# Altium project RainbowClock.PrjPcb
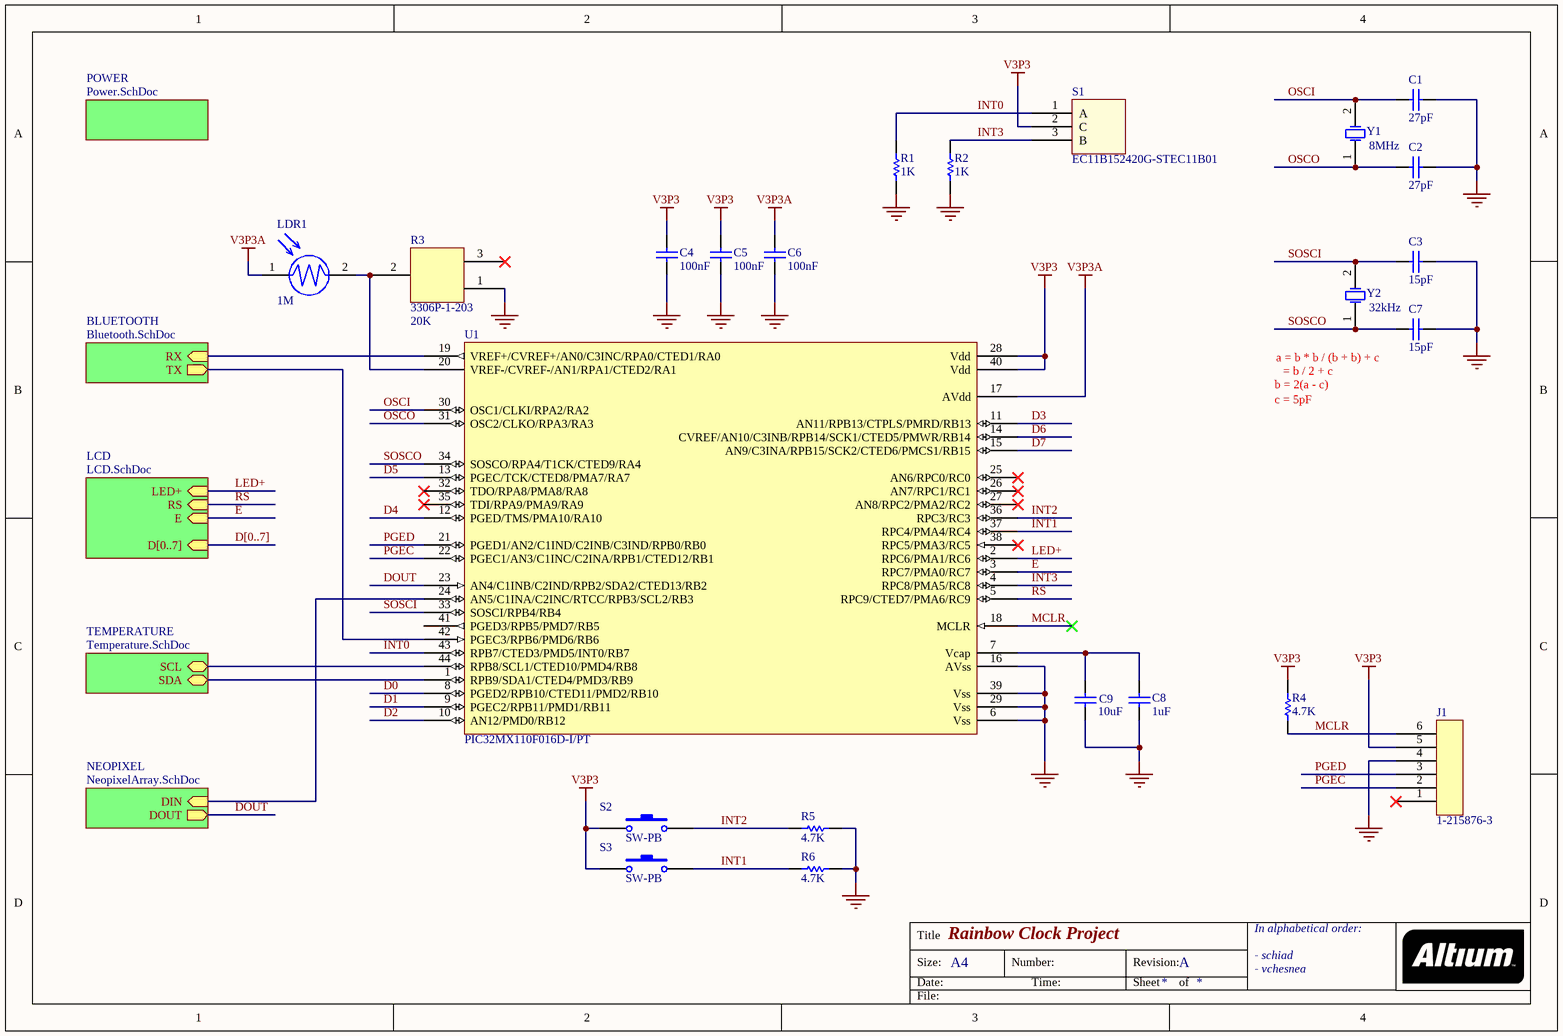
[diagram p0: RainbowClock.SchDoc]
7 sheets, 158 parts. Net scope: hierarchical (ports join the sheet entries above them; power ports are global).
Board file: BoardV2.PcbDoc
Sheets:
  RainbowClock.SchDoc
    BLUETOOTH = Bluetooth.SchDoc
    LCD = LCD.SchDoc
    TEMPERATURE = Temperature.SchDoc
    NEOPIXEL = NeopixelArray.SchDoc
      NeoPixel1 = Neopixel.SchDoc
      NeoPixel2 = Neopixel.SchDoc
      NeoPixel3 = Neopixel.SchDoc
      NeoPixel4 = Neopixel.SchDoc
      NeoPixel5 = Neopixel.SchDoc
      NeoPixel6 = Neopixel.SchDoc
      NeoPixel7 = Neopixel.SchDoc
      NeoPixel8 = Neopixel.SchDoc
      NeoPixel9 = Neopixel.SchDoc
      NeoPixel10 = Neopixel.SchDoc
      NeoPixel11 = Neopixel.SchDoc
      NeoPixel12 = Neopixel.SchDoc
      NeoPixel13 = Neopixel.SchDoc
      NeoPixel14 = Neopixel.SchDoc
      NeoPixel15 = Neopixel.SchDoc
      NeoPixel16 = Neopixel.SchDoc
      NeoPixel17 = Neopixel.SchDoc
      NeoPixel18 = Neopixel.SchDoc
      NeoPixel19 = Neopixel.SchDoc
      NeoPixel20 = Neopixel.SchDoc
      NeoPixel21 = Neopixel.SchDoc
      NeoPixel22 = Neopixel.SchDoc
      NeoPixel23 = Neopixel.SchDoc
      NeoPixel24 = Neopixel.SchDoc
      NeoPixel25 = Neopixel.SchDoc
      NeoPixel26 = Neopixel.SchDoc
      NeoPixel27 = Neopixel.SchDoc
      NeoPixel28 = Neopixel.SchDoc
      NeoPixel29 = Neopixel.SchDoc
      NeoPixel30 = Neopixel.SchDoc
      NeoPixel31 = Neopixel.SchDoc
      NeoPixel32 = Neopixel.SchDoc
      NeoPixel33 = Neopixel.SchDoc
      NeoPixel34 = Neopixel.SchDoc
      NeoPixel35 = Neopixel.SchDoc
      NeoPixel36 = Neopixel.SchDoc
      NeoPixel37 = Neopixel.SchDoc
      NeoPixel38 = Neopixel.SchDoc
      NeoPixel39 = Neopixel.SchDoc
      NeoPixel40 = Neopixel.SchDoc
      NeoPixel41 = Neopixel.SchDoc
      NeoPixel42 = Neopixel.SchDoc
      NeoPixel43 = Neopixel.SchDoc
      NeoPixel44 = Neopixel.SchDoc
      NeoPixel45 = Neopixel.SchDoc
      NeoPixel46 = Neopixel.SchDoc
      NeoPixel47 = Neopixel.SchDoc
      NeoPixel48 = Neopixel.SchDoc
      NeoPixel49 = Neopixel.SchDoc
      NeoPixel50 = Neopixel.SchDoc
      NeoPixel51 = Neopixel.SchDoc
      NeoPixel52 = Neopixel.SchDoc
      NeoPixel53 = Neopixel.SchDoc
      NeoPixel54 = Neopixel.SchDoc
      NeoPixel55 = Neopixel.SchDoc
      NeoPixel56 = Neopixel.SchDoc
      NeoPixel57 = Neopixel.SchDoc
      NeoPixel58 = Neopixel.SchDoc
      NeoPixel59 = Neopixel.SchDoc
      NeoPixel60 = Neopixel.SchDoc
    POWER = Power.SchDoc

## Sheet RainbowClock.SchDoc: Rainbow Clock Project
size A4; DrawnBy: vchesnea; Organization: In alphabetical order:; Address2: - schiad; Address3: - vchesnea; Revision: A

### Parts
C1  27pF  [CAP0603]
C2  27pF  [CAP0603]
C3  15pF  [CAP0603]
C4  100nF  [CAP0603]
C5  100nF  [CAP0603]
C6  100nF  [CAP0603]
C7  15pF  [CAP0603]
C8  1uF  [CAP0603]
C9  10uF  [CAP0603]
J1  1-215876-3  [1-215876-3]
LDR1  value 1M  [VT935G]  (hidden comment: LDR)
R1  1K  [RES0603]
R2  1K  [RES0603]
R3  3306P-1-203  value 20K  [3306P-1-202]
R4  4.7K  [RES0603]
R5  4.7K  [RES0603]
R6  4.7K  [RES0603]
S1  EC11B152420G-STEC11B01  [EC11B152420G-STEC11B01]
S2  SW-PB  [1-1825027-4]
S3  SW-PB  [1-1825027-4]
U1  PIC32MX110F016D-I/PT  [PIC32MX110F016H-I/PT]
Y1  value 8MHz  [FOXSLF/080-20]  (hidden comment: 8MHz XTAL)
Y2  value 32kHz  [NCL38LF]  (hidden comment: 32kHz XTAL)

### Sub-sheets
BLUETOOTH = Bluetooth.SchDoc: RX (in), TX (out)
LCD = LCD.SchDoc: RS (in), E (in), LED+ (in), D[0..7] (in)
NEOPIXEL = NeopixelArray.SchDoc: DIN (in), DOUT (out)
POWER = Power.SchDoc: no entries
TEMPERATURE = Temperature.SchDoc: SDA (bidir), SCL (bidir)

### Nets
GND: C1.2 C2.2 C3.2 C4.1 C5.1 C6.1 C7.2 C8.1 C9.1 J1.4 R1.2 R2.1 R3.1 R5.1 R6.1 U1.6(Vss) U1.16(AVss) U1.29(Vss) U1.39(Vss)
V3P3: C4.2 C5.2 J1.5 R4.2 S1.2(C) S2.1 S3.2 U1.28(Vdd) U1.40(Vdd)
V3P3A: C6.2 LDR1.1 U1.17(AVdd)
D0: U1.8(PGED2/RPB10/CTED11/PMD2/RB10)
D1: U1.9(PGEC2/RPB11/PMD1/RB11)
D2: U1.10(AN12/PMD0/RB12)
D3: U1.11(AN11/RPB13/CTPLS/PMRD/RB13)
D4: U1.12(PGED/TMS/PMA10/RA10)
D5: U1.13(PGEC/TCK/CTED8/PMA7/RA7)
D6: U1.14(CVREF/AN10/C3INB/RPB14/SCK1/CTED5/PMWR/RB14)
D7: U1.15(AN9/C3INA/RPB15/SCK2/CTED6/PMCS1/RB15)
DOUT: U1.23(AN4/C1INB/C2IND/RPB2/SDA2/CTED13/RB2) ; sheet NEOPIXEL/DOUT
E: U1.3(RPC7/PMA0/RC7) ; sheet LCD/E
INT0: R1.1 S1.1(A) U1.43(RPB7/CTED3/PMD5/INT0/RB7)
INT1: R6.2 S3.1 U1.37(RPC4/PMA4/RC4)
INT2: R5.2 S2.2 U1.36(RPC3/RC3)
INT3: R2.2 S1.3(B) U1.4(RPC8/PMA5/RC8)
LED+: U1.2(RPC6/PMA1/RC6) ; sheet LCD/LED+
MCLR: J1.6 R4.1 U1.18(MCLR)
OSCI: C1.1 U1.30(OSC1/CLKI/RPA2/RA2) Y1.2(OSC2)
OSCO: C2.1 U1.31(OSC2/CLKO/RPA3/RA3) Y1.1(OSC1)
PGEC: J1.2 U1.22(PGEC1/AN3/C1INC/C2INA/RPB1/CTED12/RB1)
PGED: J1.3 U1.21(PGED1/AN2/C1IND/C2INB/C3IND/RPB0/RB0)
PX1: U1.24(AN5/C1INA/C2INC/RTCC/RPB3/SCL2/RB3) ; sheet NEOPIXEL/DIN
RS: U1.5(RPC9/CTED7/PMA6/RC9) ; sheet LCD/RS
RX: U1.19(VREF+/CVREF+/AN0/C3INC/RPA0/CTED1/RA0) ; sheet BLUETOOTH/RX
SCL: U1.44(RPB8/SCL1/CTED10/PMD4/RB8) ; sheet TEMPERATURE/SCL
SDA: U1.1(RPB9/SDA1/CTED4/PMD3/RB9) ; sheet TEMPERATURE/SDA
SOSCI: C3.1 U1.33(SOSCI/RPB4/RB4) Y2.2(OSC2)
SOSCO: C7.1 U1.34(SOSCO/RPA4/T1CK/CTED9/RA4) Y2.1(OSC1)
TX: U1.42(PGEC3/RPB6/PMD6/RB6) ; sheet BLUETOOTH/TX
NetC8_2: C8.2 C9.2 U1.7(Vcap)
NetLDR1_2: LDR1.2 R3.2 U1.20(VREF-/CVREF-/AN1/RPA1/CTED2/RA1)

Not connected (* = marked no-connect by the designer): J1 1*; R3 3*; U1 25(AN6/RPC0/RC0)* 26(AN7/RPC1/RC1)* 27(AN8/RPC2/PMA2/RC2)* 32(TDO/RPA8/PMA8/RA8)* 35(TDI/RPA9/PMA9/RA9)* 38(RPC5/PMA3/RC5)* 41(PGED3/RPB5/PMD7/RB5)

### Buses and harness runs
bus D[0..7] = sheet LCD/D[0..7]

### Notes on the sheet
- (near C7) a = b * b / (b + b) + c
- = b / 2 + c
- b = 2(a - c)
- c = 5pF
- Title
- Size:
- Date:
- A4
- Number:
- Time:
- Revision:
- Sheet
- of
- File:

### Library data of the parts
C1-C9 = Cap: Capacitor
  C1 C2: Value: 27pF
  C3 C7: Value: 15pF
  C4-C6: Value: 100nF
  C8: Value: 1uF
  C9: Value: 10uF
J1 = 1-215876-3: Tyco 1-215876-3; RefFournisseur: 1773039; Fabricant: TE Connectivity; Fournisseur: Farnell; RefFabricant: 1-215876-3
LDR1 = LDR: Photoresistor; RefFournisseur: 1652638; Fabricant: Excelitas Tech; Fournisseur: Farnell; RefFabricant: VT935G
R1 R2 R4-R6 = Res1: Resistor
  R1 R2: Value: 1K
  R4-R6: Value: 4.7K
R3 = 3306P-1-202: Trimpot; RefFournisseur: 108240; Fabricant: Bourns; Fournisseur: Farnell; RefFabricant: 3306P-1-203
S1 = EC11B152420G-STEC11B01: Rotary encoder; RefFournisseur: 1191733; Fournisseur: Farnell; Fabricant: ALPS; RefFabricant: EC11B152420G-STEC11B01
S2 S3 = SW-PB: Switch; RefFournisseur: 2468742; Fournisseur: Farnell; Fabricant: TE Connectivity; RefFabricant: 1-1825027-4
U1 = PIC32MX110F016D-I/PT: Microcontroller; RefFournisseur: 2057068; Fabricant: Microchip; Fournisseur: Farnell; RefFabricant: PIC32MX110F016D-I/PT
Y1 = XTAL: Crystal Oscillator; Fournisseur: Farnell; Fabricant: Fox Electronics; RefFournisseur: 2057960; RefFabricant: FOXSLF/080-20
Y2 = XTAL: Crystal Oscillator; Fabricant: Fox Electronics; Fournisseur: Farnell; RefFabricant: NC38LF-327; RefFournisseur: 2064058

## Sheet Bluetooth.SchDoc: Serial to Bluetooth module
size A4
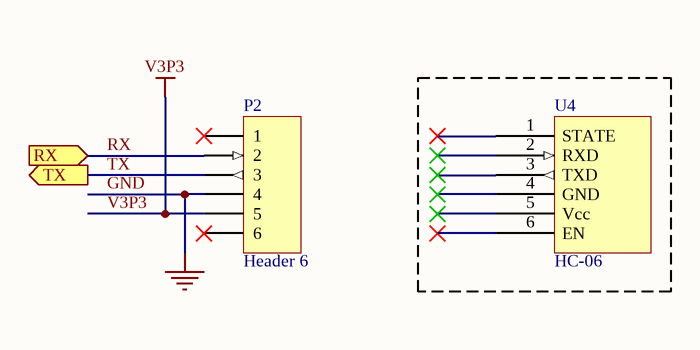
[diagram p1: Bluetooth.SchDoc]

### Parts
P2  Header 6  [Header 6]
U4  HC-06  (mechanical)

### Ports
RX (in), TX (out)

### Nets
GND: P2.4
V3P3: P2.5
RX: P2.2 ; port RX
TX: P2.3 ; port TX

Not connected (* = marked no-connect by the designer): P2 1* 6*; U4 1(STATE)* 2(RXD)* 3(TXD)* 4(GND)* 5(Vcc)* 6(EN)*

### Notes on the sheet
- Title
- Size:
- Date:
- A4
- Number:
- Time:
- Revision:
- Sheet
- of
- File:

### Library data of the parts
P2 = Header 6: Header, 6-Pin; Fabricant: MULTICOMP; Fournisseur: Farnell; RefFournisseur: 1593462; RefFabricant: 2212S-06SG-85
U4 = HC-06: Bluetooth; Fabricant: Wavesen; RefFabricant: HC-06

## Sheet LCD.SchDoc: 20x4 Characters LCD
size A4
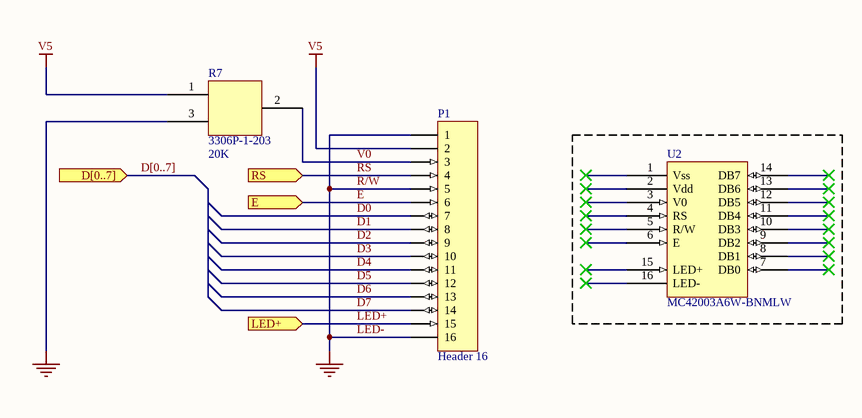
[diagram p2: LCD.SchDoc]

### Parts
P1  Header 16  [Header 16]
R7  3306P-1-203  value 20K  [3306P-1-202]
U2  MC42003A6W-BNMLW  [MC42004A6W-BNMLW]  (mechanical)

### Ports
D[0..7] (in), E (in), LED+ (in), RS (in)

### Nets
GND: P1.1 P1.5 P1.16 R7.3  [also labelled LED-, R/W]
V5: P1.2 R7.1
D0: P1.7
D1: P1.8
D2: P1.9
D3: P1.10
D4: P1.11
D5: P1.12
D6: P1.13
D7: P1.14
E: P1.6 ; port E
LED+: P1.15 ; port LED+
RS: P1.4 ; port RS
V0: P1.3 R7.2

Not connected (* = marked no-connect by the designer): U2 1(Vss)* 2(Vdd)* 3(V0)* 4(RS)* 5(R/W)* 6(E)* 7(DB0)* 8(DB1)* 9(DB2)* 10(DB3)* 11(DB4)* 12(DB5)* 13(DB6)* 14(DB7)* 15(LED+)* 16(LED-)*

### Buses and harness runs
bus D[0..7] = port D[0..7]

### Notes on the sheet
- Title
- Size:
- Date:
- A4
- Number:
- Time:
- Revision:
- Sheet
- of
- File:

### Library data of the parts
P1 = Header 16: Header, 16-Pin; Fabricant: SAMTEC; Fournisseur: Farnell; RefFabricant: CES-116-01-T-S; RefFournisseur: 1667522
R7 = 3306P-1-202: as R3 on sheet RainbowClock; RefFabricant: 3306P-1-203
U2 = MC42003A6W-BNMLW: LCD; Fabricant: MIDAS; Fournisseur: Farnell; RefFournisseur: 2063162; RefFabricant: MC42004A6W-BNMLW

## Sheet Temperature.SchDoc: BMP280 Sensor
size A4
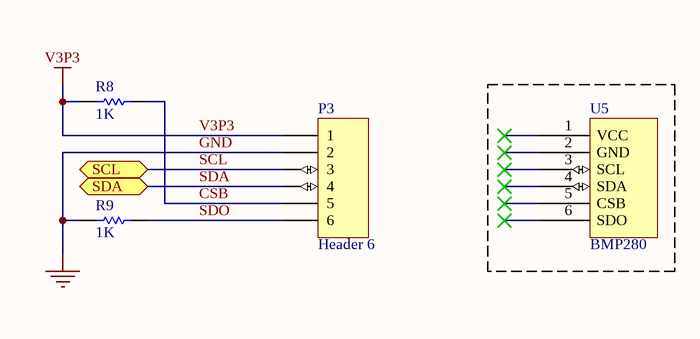
[diagram p3: Temperature.SchDoc]

### Parts
P3  Header 6  [Header 6]
R8  1K  [RES0603]
R9  1K  [RES0603]
U5  BMP280  (mechanical)

### Ports
SCL (bidir), SDA (bidir)

### Nets
GND: P3.2 R9.1
V3P3: P3.1 R8.1
CSB: P3.5 R8.2
SCL: P3.3 ; port SCL
SDA: P3.4 ; port SDA
SDO: P3.6 R9.2

Not connected (* = marked no-connect by the designer): U5 1(VCC)* 2(GND)* 3(SCL)* 4(SDA)* 5(CSB)* 6(SDO)*

### Notes on the sheet
- Title
- Size:
- Date:
- A4
- Number:
- Time:
- Revision:
- Sheet
- of
- File:

### Library data of the parts
P3 = Header 6: Header, 6-Pin; Fournisseur: Farnell; Fabricant: MULTICOMP; RefFournisseur: 1593462; RefFabricant: 2212S-06SG-85
R8 R9 = Res1: Resistor; Published: 8-Jun-2000; LatestRevisionDate: 17-Jul-2002; LatestRevisionNote: Re-released for DXP Platform.; PackageReference: AXIAL-0.3; Publisher: Altium Limited; PackageDescription: Axial Device, Thru-Hole; 2 Leads; 0.3 in Pin Spacing; Value: 1K
U5 = BMP280: Temp. sensor; Fabricant: BOSCH; RefFabricant: BMP280

## Sheet NeopixelArray.SchDoc: Neopixel array
size A4
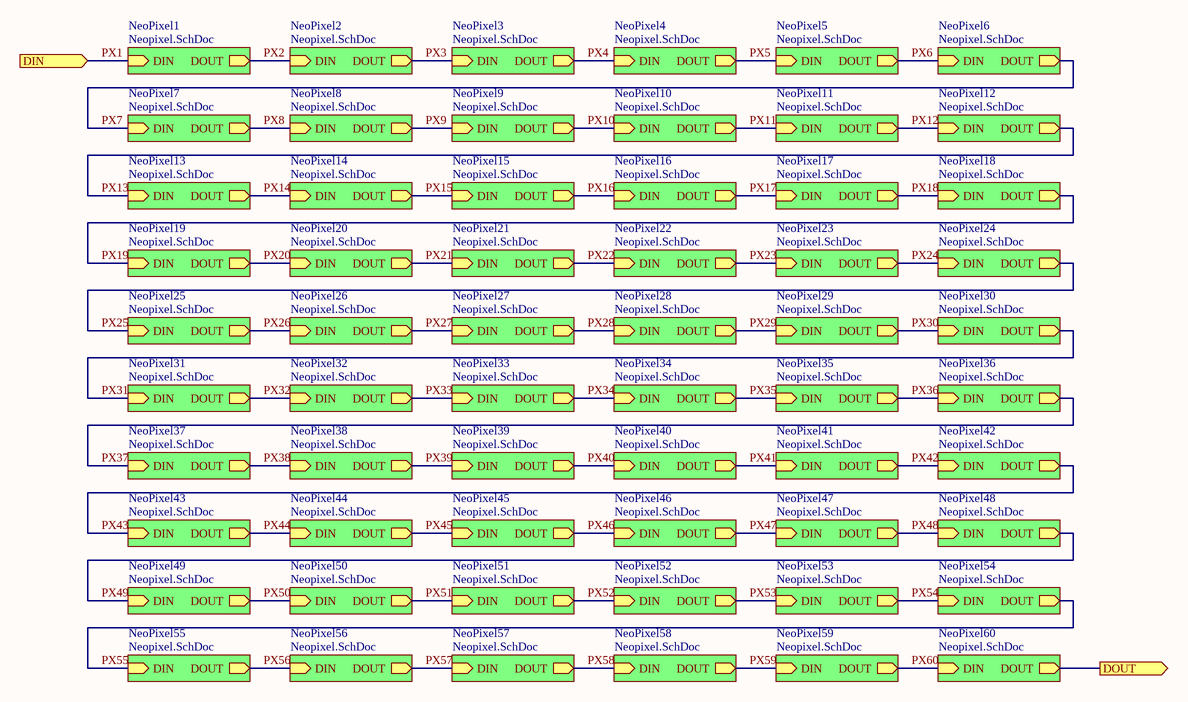
[diagram p4: NeopixelArray.SchDoc]

### Sub-sheets
NeoPixel1 = Neopixel.SchDoc: DIN (in), DOUT (out)
NeoPixel2 = Neopixel.SchDoc: DIN (in), DOUT (out)
NeoPixel3 = Neopixel.SchDoc: DIN (in), DOUT (out)
NeoPixel4 = Neopixel.SchDoc: DIN (in), DOUT (out)
NeoPixel5 = Neopixel.SchDoc: DIN (in), DOUT (out)
NeoPixel6 = Neopixel.SchDoc: DIN (in), DOUT (out)
NeoPixel7 = Neopixel.SchDoc: DIN (in), DOUT (out)
NeoPixel8 = Neopixel.SchDoc: DIN (in), DOUT (out)
NeoPixel9 = Neopixel.SchDoc: DIN (in), DOUT (out)
NeoPixel10 = Neopixel.SchDoc: DIN (in), DOUT (out)
NeoPixel11 = Neopixel.SchDoc: DIN (in), DOUT (out)
NeoPixel12 = Neopixel.SchDoc: DIN (in), DOUT (out)
NeoPixel13 = Neopixel.SchDoc: DIN (in), DOUT (out)
NeoPixel14 = Neopixel.SchDoc: DIN (in), DOUT (out)
NeoPixel15 = Neopixel.SchDoc: DIN (in), DOUT (out)
NeoPixel16 = Neopixel.SchDoc: DIN (in), DOUT (out)
NeoPixel17 = Neopixel.SchDoc: DIN (in), DOUT (out)
NeoPixel18 = Neopixel.SchDoc: DIN (in), DOUT (out)
NeoPixel19 = Neopixel.SchDoc: DIN (in), DOUT (out)
NeoPixel20 = Neopixel.SchDoc: DIN (in), DOUT (out)
NeoPixel21 = Neopixel.SchDoc: DIN (in), DOUT (out)
NeoPixel22 = Neopixel.SchDoc: DIN (in), DOUT (out)
NeoPixel23 = Neopixel.SchDoc: DIN (in), DOUT (out)
NeoPixel24 = Neopixel.SchDoc: DIN (in), DOUT (out)
NeoPixel25 = Neopixel.SchDoc: DIN (in), DOUT (out)
NeoPixel26 = Neopixel.SchDoc: DIN (in), DOUT (out)
NeoPixel27 = Neopixel.SchDoc: DIN (in), DOUT (out)
NeoPixel28 = Neopixel.SchDoc: DIN (in), DOUT (out)
NeoPixel29 = Neopixel.SchDoc: DIN (in), DOUT (out)
NeoPixel30 = Neopixel.SchDoc: DIN (in), DOUT (out)
NeoPixel31 = Neopixel.SchDoc: DIN (in), DOUT (out)
NeoPixel32 = Neopixel.SchDoc: DIN (in), DOUT (out)
NeoPixel33 = Neopixel.SchDoc: DIN (in), DOUT (out)
NeoPixel34 = Neopixel.SchDoc: DIN (in), DOUT (out)
NeoPixel35 = Neopixel.SchDoc: DIN (in), DOUT (out)
NeoPixel36 = Neopixel.SchDoc: DIN (in), DOUT (out)
NeoPixel37 = Neopixel.SchDoc: DIN (in), DOUT (out)
NeoPixel38 = Neopixel.SchDoc: DIN (in), DOUT (out)
NeoPixel39 = Neopixel.SchDoc: DIN (in), DOUT (out)
NeoPixel40 = Neopixel.SchDoc: DIN (in), DOUT (out)
NeoPixel41 = Neopixel.SchDoc: DIN (in), DOUT (out)
NeoPixel42 = Neopixel.SchDoc: DIN (in), DOUT (out)
NeoPixel43 = Neopixel.SchDoc: DIN (in), DOUT (out)
NeoPixel44 = Neopixel.SchDoc: DIN (in), DOUT (out)
NeoPixel45 = Neopixel.SchDoc: DIN (in), DOUT (out)
NeoPixel46 = Neopixel.SchDoc: DIN (in), DOUT (out)
NeoPixel47 = Neopixel.SchDoc: DIN (in), DOUT (out)
NeoPixel48 = Neopixel.SchDoc: DIN (in), DOUT (out)
NeoPixel49 = Neopixel.SchDoc: DIN (in), DOUT (out)
NeoPixel50 = Neopixel.SchDoc: DIN (in), DOUT (out)
NeoPixel51 = Neopixel.SchDoc: DIN (in), DOUT (out)
NeoPixel52 = Neopixel.SchDoc: DIN (in), DOUT (out)
NeoPixel53 = Neopixel.SchDoc: DIN (in), DOUT (out)
NeoPixel54 = Neopixel.SchDoc: DIN (in), DOUT (out)
NeoPixel55 = Neopixel.SchDoc: DIN (in), DOUT (out)
NeoPixel56 = Neopixel.SchDoc: DIN (in), DOUT (out)
NeoPixel57 = Neopixel.SchDoc: DIN (in), DOUT (out)
NeoPixel58 = Neopixel.SchDoc: DIN (in), DOUT (out)
NeoPixel59 = Neopixel.SchDoc: DIN (in), DOUT (out)
NeoPixel60 = Neopixel.SchDoc: DIN (in), DOUT (out)

### Ports
DIN (in), DOUT (out)

### Nets
DOUT: port DOUT, sheet NeoPixel60/DOUT
PX1: port DIN, sheet NeoPixel1/DIN
PX2: sheet NeoPixel1/DOUT, sheet NeoPixel2/DIN
PX3: sheet NeoPixel2/DOUT, sheet NeoPixel3/DIN
PX4: sheet NeoPixel3/DOUT, sheet NeoPixel4/DIN
PX5: sheet NeoPixel4/DOUT, sheet NeoPixel5/DIN
PX6: sheet NeoPixel5/DOUT, sheet NeoPixel6/DIN
PX7: sheet NeoPixel6/DOUT, sheet NeoPixel7/DIN
PX8: sheet NeoPixel7/DOUT, sheet NeoPixel8/DIN
PX9: sheet NeoPixel8/DOUT, sheet NeoPixel9/DIN
PX10: sheet NeoPixel9/DOUT, sheet NeoPixel10/DIN
PX11: sheet NeoPixel10/DOUT, sheet NeoPixel11/DIN
PX12: sheet NeoPixel11/DOUT, sheet NeoPixel12/DIN
PX13: sheet NeoPixel12/DOUT, sheet NeoPixel13/DIN
PX14: sheet NeoPixel13/DOUT, sheet NeoPixel14/DIN
PX15: sheet NeoPixel14/DOUT, sheet NeoPixel15/DIN
PX16: sheet NeoPixel15/DOUT, sheet NeoPixel16/DIN
PX17: sheet NeoPixel16/DOUT, sheet NeoPixel17/DIN
PX18: sheet NeoPixel17/DOUT, sheet NeoPixel18/DIN
PX19: sheet NeoPixel18/DOUT, sheet NeoPixel19/DIN
PX20: sheet NeoPixel19/DOUT, sheet NeoPixel20/DIN
PX21: sheet NeoPixel20/DOUT, sheet NeoPixel21/DIN
PX22: sheet NeoPixel21/DOUT, sheet NeoPixel22/DIN
PX23: sheet NeoPixel22/DOUT, sheet NeoPixel23/DIN
PX24: sheet NeoPixel23/DOUT, sheet NeoPixel24/DIN
PX25: sheet NeoPixel24/DOUT, sheet NeoPixel25/DIN
PX26: sheet NeoPixel25/DOUT, sheet NeoPixel26/DIN
PX27: sheet NeoPixel26/DOUT, sheet NeoPixel27/DIN
PX28: sheet NeoPixel27/DOUT, sheet NeoPixel28/DIN
PX29: sheet NeoPixel28/DOUT, sheet NeoPixel29/DIN
PX30: sheet NeoPixel29/DOUT, sheet NeoPixel30/DIN
PX31: sheet NeoPixel30/DOUT, sheet NeoPixel31/DIN
PX32: sheet NeoPixel31/DOUT, sheet NeoPixel32/DIN
PX33: sheet NeoPixel32/DOUT, sheet NeoPixel33/DIN
PX34: sheet NeoPixel33/DOUT, sheet NeoPixel34/DIN
PX35: sheet NeoPixel34/DOUT, sheet NeoPixel35/DIN
PX36: sheet NeoPixel35/DOUT, sheet NeoPixel36/DIN
PX37: sheet NeoPixel36/DOUT, sheet NeoPixel37/DIN
PX38: sheet NeoPixel37/DOUT, sheet NeoPixel38/DIN
PX39: sheet NeoPixel38/DOUT, sheet NeoPixel39/DIN
PX40: sheet NeoPixel39/DOUT, sheet NeoPixel40/DIN
PX41: sheet NeoPixel40/DOUT, sheet NeoPixel41/DIN
PX42: sheet NeoPixel41/DOUT, sheet NeoPixel42/DIN
PX43: sheet NeoPixel42/DOUT, sheet NeoPixel43/DIN
PX44: sheet NeoPixel43/DOUT, sheet NeoPixel44/DIN
PX45: sheet NeoPixel44/DOUT, sheet NeoPixel45/DIN
PX46: sheet NeoPixel45/DOUT, sheet NeoPixel46/DIN
PX47: sheet NeoPixel46/DOUT, sheet NeoPixel47/DIN
PX48: sheet NeoPixel47/DOUT, sheet NeoPixel48/DIN
PX49: sheet NeoPixel48/DOUT, sheet NeoPixel49/DIN
PX50: sheet NeoPixel49/DOUT, sheet NeoPixel50/DIN
PX51: sheet NeoPixel50/DOUT, sheet NeoPixel51/DIN
PX52: sheet NeoPixel51/DOUT, sheet NeoPixel52/DIN
PX53: sheet NeoPixel52/DOUT, sheet NeoPixel53/DIN
PX54: sheet NeoPixel53/DOUT, sheet NeoPixel54/DIN
PX55: sheet NeoPixel54/DOUT, sheet NeoPixel55/DIN
PX56: sheet NeoPixel55/DOUT, sheet NeoPixel56/DIN
PX57: sheet NeoPixel56/DOUT, sheet NeoPixel57/DIN
PX58: sheet NeoPixel57/DOUT, sheet NeoPixel58/DIN
PX59: sheet NeoPixel58/DOUT, sheet NeoPixel59/DIN
PX60: sheet NeoPixel59/DOUT, sheet NeoPixel60/DIN

### Notes on the sheet
- Title
- Size:
- Date:
- A4
- Number:
- Time:
- Revision:
- Sheet
- of
- File:

## Sheet Neopixel.SchDoc: Neopixel
size A4
Used 60 times, as channels NEOPIXEL/NeoPixel1, NEOPIXEL/NeoPixel2, NEOPIXEL/NeoPixel3, NEOPIXEL/NeoPixel4, NEOPIXEL/NeoPixel5, NEOPIXEL/NeoPixel6, NEOPIXEL/NeoPixel7, NEOPIXEL/NeoPixel8, NEOPIXEL/NeoPixel9, NEOPIXEL/NeoPixel10, NEOPIXEL/NeoPixel11, NEOPIXEL/NeoPixel12, NEOPIXEL/NeoPixel13, NEOPIXEL/NeoPixel14, NEOPIXEL/NeoPixel15, NEOPIXEL/NeoPixel16, NEOPIXEL/NeoPixel17, NEOPIXEL/NeoPixel18, NEOPIXEL/NeoPixel19, NEOPIXEL/NeoPixel20, NEOPIXEL/NeoPixel21, NEOPIXEL/NeoPixel22, NEOPIXEL/NeoPixel23, NEOPIXEL/NeoPixel24, NEOPIXEL/NeoPixel25, NEOPIXEL/NeoPixel26, NEOPIXEL/NeoPixel27, NEOPIXEL/NeoPixel28, NEOPIXEL/NeoPixel29, NEOPIXEL/NeoPixel30, NEOPIXEL/NeoPixel31, NEOPIXEL/NeoPixel32, NEOPIXEL/NeoPixel33, NEOPIXEL/NeoPixel34, NEOPIXEL/NeoPixel35, NEOPIXEL/NeoPixel36, NEOPIXEL/NeoPixel37, NEOPIXEL/NeoPixel38, NEOPIXEL/NeoPixel39, NEOPIXEL/NeoPixel40, NEOPIXEL/NeoPixel41, NEOPIXEL/NeoPixel42, NEOPIXEL/NeoPixel43, NEOPIXEL/NeoPixel44, NEOPIXEL/NeoPixel45, NEOPIXEL/NeoPixel46, NEOPIXEL/NeoPixel47, NEOPIXEL/NeoPixel48, NEOPIXEL/NeoPixel49, NEOPIXEL/NeoPixel50, NEOPIXEL/NeoPixel51, NEOPIXEL/NeoPixel52, NEOPIXEL/NeoPixel53, NEOPIXEL/NeoPixel54, NEOPIXEL/NeoPixel55, NEOPIXEL/NeoPixel56, NEOPIXEL/NeoPixel57, NEOPIXEL/NeoPixel58, NEOPIXEL/NeoPixel59, NEOPIXEL/NeoPixel60. Parts and nets are listed once, with the designators drawn on the sheet.
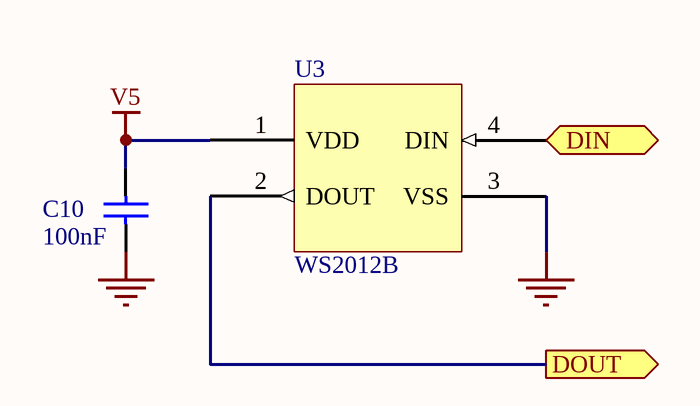
[diagram p5: Neopixel.SchDoc]

### Parts
C10  100nF  [CAP0603]
U3  WS2012B  [WS2812b]

### Ports
DIN (in), DOUT (out)

### Nets
GND: C10.1 U3.3(VSS)
V5: C10.2 U3.1(VDD)
DIN: U3.4(DIN) ; port DIN
DOUT: U3.2(DOUT) ; port DOUT

### Channels
NEOPIXEL/NeoPixel1: designators end in #1; ports DIN=PX1 DOUT=PX2
NEOPIXEL/NeoPixel2: designators end in #2; ports DIN=PX2 DOUT=PX3
NEOPIXEL/NeoPixel3: designators end in #3; ports DIN=PX3 DOUT=PX4
NEOPIXEL/NeoPixel4: designators end in #4; ports DIN=PX4 DOUT=PX5
NEOPIXEL/NeoPixel5: designators end in #5; ports DIN=PX5 DOUT=PX6
NEOPIXEL/NeoPixel6: designators end in #6; ports DIN=PX6 DOUT=PX7
NEOPIXEL/NeoPixel7: designators end in #7; ports DIN=PX7 DOUT=PX8
NEOPIXEL/NeoPixel8: designators end in #8; ports DIN=PX8 DOUT=PX9
NEOPIXEL/NeoPixel9: designators end in #9; ports DIN=PX9 DOUT=PX10
NEOPIXEL/NeoPixel10: designators end in #10; ports DIN=PX10 DOUT=PX11
NEOPIXEL/NeoPixel11: designators end in #11; ports DIN=PX11 DOUT=PX12
NEOPIXEL/NeoPixel12: designators end in #12; ports DIN=PX12 DOUT=PX13
NEOPIXEL/NeoPixel13: designators end in #13; ports DIN=PX13 DOUT=PX14
NEOPIXEL/NeoPixel14: designators end in #14; ports DIN=PX14 DOUT=PX15
NEOPIXEL/NeoPixel15: designators end in #15; ports DIN=PX15 DOUT=PX16
NEOPIXEL/NeoPixel16: designators end in #16; ports DIN=PX16 DOUT=PX17
NEOPIXEL/NeoPixel17: designators end in #17; ports DIN=PX17 DOUT=PX18
NEOPIXEL/NeoPixel18: designators end in #18; ports DIN=PX18 DOUT=PX19
NEOPIXEL/NeoPixel19: designators end in #19; ports DIN=PX19 DOUT=PX20
NEOPIXEL/NeoPixel20: designators end in #20; ports DIN=PX20 DOUT=PX21
NEOPIXEL/NeoPixel21: designators end in #21; ports DIN=PX21 DOUT=PX22
NEOPIXEL/NeoPixel22: designators end in #22; ports DIN=PX22 DOUT=PX23
NEOPIXEL/NeoPixel23: designators end in #23; ports DIN=PX23 DOUT=PX24
NEOPIXEL/NeoPixel24: designators end in #24; ports DIN=PX24 DOUT=PX25
NEOPIXEL/NeoPixel25: designators end in #25; ports DIN=PX25 DOUT=PX26
NEOPIXEL/NeoPixel26: designators end in #26; ports DIN=PX26 DOUT=PX27
NEOPIXEL/NeoPixel27: designators end in #27; ports DIN=PX27 DOUT=PX28
NEOPIXEL/NeoPixel28: designators end in #28; ports DIN=PX28 DOUT=PX29
NEOPIXEL/NeoPixel29: designators end in #29; ports DIN=PX29 DOUT=PX30
NEOPIXEL/NeoPixel30: designators end in #30; ports DIN=PX30 DOUT=PX31
NEOPIXEL/NeoPixel31: designators end in #31; ports DIN=PX31 DOUT=PX32
NEOPIXEL/NeoPixel32: designators end in #32; ports DIN=PX32 DOUT=PX33
NEOPIXEL/NeoPixel33: designators end in #33; ports DIN=PX33 DOUT=PX34
NEOPIXEL/NeoPixel34: designators end in #34; ports DIN=PX34 DOUT=PX35
NEOPIXEL/NeoPixel35: designators end in #35; ports DIN=PX35 DOUT=PX36
NEOPIXEL/NeoPixel36: designators end in #36; ports DIN=PX36 DOUT=PX37
NEOPIXEL/NeoPixel37: designators end in #37; ports DIN=PX37 DOUT=PX38
NEOPIXEL/NeoPixel38: designators end in #38; ports DIN=PX38 DOUT=PX39
NEOPIXEL/NeoPixel39: designators end in #39; ports DIN=PX39 DOUT=PX40
NEOPIXEL/NeoPixel40: designators end in #40; ports DIN=PX40 DOUT=PX41
NEOPIXEL/NeoPixel41: designators end in #41; ports DIN=PX41 DOUT=PX42
NEOPIXEL/NeoPixel42: designators end in #42; ports DIN=PX42 DOUT=PX43
NEOPIXEL/NeoPixel43: designators end in #43; ports DIN=PX43 DOUT=PX44
NEOPIXEL/NeoPixel44: designators end in #44; ports DIN=PX44 DOUT=PX45
NEOPIXEL/NeoPixel45: designators end in #45; ports DIN=PX45 DOUT=PX46
NEOPIXEL/NeoPixel46: designators end in #46; ports DIN=PX46 DOUT=PX47
NEOPIXEL/NeoPixel47: designators end in #47; ports DIN=PX47 DOUT=PX48
NEOPIXEL/NeoPixel48: designators end in #48; ports DIN=PX48 DOUT=PX49
NEOPIXEL/NeoPixel49: designators end in #49; ports DIN=PX49 DOUT=PX50
NEOPIXEL/NeoPixel50: designators end in #50; ports DIN=PX50 DOUT=PX51
NEOPIXEL/NeoPixel51: designators end in #51; ports DIN=PX51 DOUT=PX52
NEOPIXEL/NeoPixel52: designators end in #52; ports DIN=PX52 DOUT=PX53
NEOPIXEL/NeoPixel53: designators end in #53; ports DIN=PX53 DOUT=PX54
NEOPIXEL/NeoPixel54: designators end in #54; ports DIN=PX54 DOUT=PX55
NEOPIXEL/NeoPixel55: designators end in #55; ports DIN=PX55 DOUT=PX56
NEOPIXEL/NeoPixel56: designators end in #56; ports DIN=PX56 DOUT=PX57
NEOPIXEL/NeoPixel57: designators end in #57; ports DIN=PX57 DOUT=PX58
NEOPIXEL/NeoPixel58: designators end in #58; ports DIN=PX58 DOUT=PX59
NEOPIXEL/NeoPixel59: designators end in #59; ports DIN=PX59 DOUT=PX60
NEOPIXEL/NeoPixel60: designators end in #60; ports DIN=PX60 DOUT=DOUT

### Notes on the sheet
- Title
- Size:
- Date:
- A4
- Number:
- Time:
- Revision:
- Sheet
- of
- File:

### Library data of the parts
C10 = Cap: Capacitor; Fabricant: TDK; Fournisseur: Farnell; RefFabricant: C1608X7R1H104K080AA; RefFournisseur: 1907318; Value: 100nF
U3 = WS2012B: Neopixel; Fabricant: WorldSemi; RefFabricant: WS2812b

## Sheet Power.SchDoc: Power
size A4; CompanyName: 42; Engineer: SCHIAD VCHESNEA
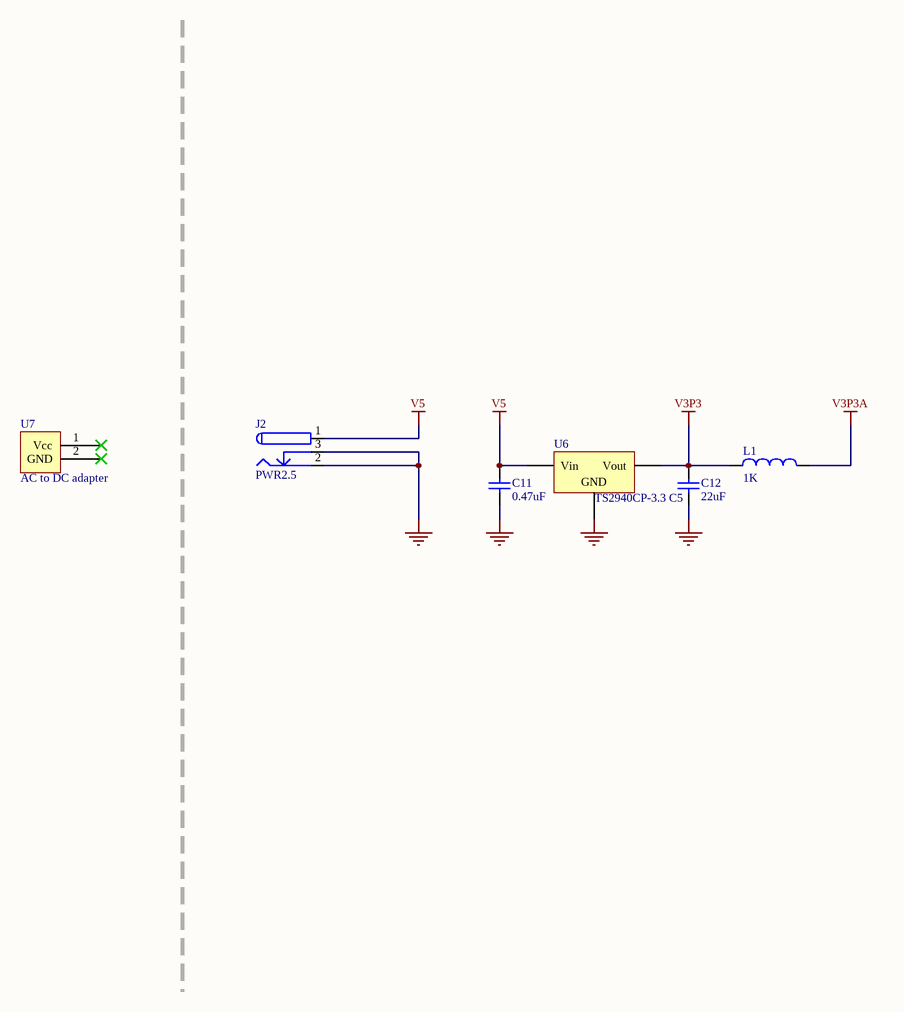
[diagram p6: Power.SchDoc]

### Parts
C11  0.47uF  [CAP0603]
C12  22uF  [CAP0603]
J2  PWR2.5  [MJ-179PH]
L1  1K  [IND0603]
U6  TS2940CP-3.3 C5  [TS2940CP-3.3 C5]
U7  AC to DC adapter  (mechanical)

### Nets
GND: C11.1 C12.1 J2.2 J2.3 U6.2(GND)
V3P3: C12.2 L1.1 U6.3(Vout)
V3P3A: L1.2
V5: C11.2 J2.1 U6.1(Vin)

Not connected (* = marked no-connect by the designer): U7 1(Vcc)* 2(GND)*

### Notes on the sheet
- Title
- Size:
- Date:
- A4
- Number:
- Time:
- Revision:
- Sheet
- of
- File:

### Library data of the parts
C11 C12 = Cap: Capacitor; Published: 8-Jun-2000; LatestRevisionDate: 17-Jul-2002; LatestRevisionNote: Re-released for DXP Platform.; PackageReference: RAD-0.3; Publisher: Altium Limited; PackageDescription: Radial Cap, Thru-Hole; 2 Leads; 0.3 in Pin Spacing
  C11: Value: 0.47uF
  C12: Value: 22uF
J2 = PWR2.5: Low Voltage Power Supply Connector; Fabricant: MULTICOMP; Fournisseur: Farnell; RefFournisseur: 1737246; RefFabricant: MJ-179PH
L1 = Inductor: Code_IEC: 1005; RefFournisseur: 1115051; RefFabricant: BLM18TG102TN1D; Fabricant: Murata; Fournisseur: Farnell; Published: 8-Jun-2000; LatestRevisionDate: 29-May-2009; LatestRevisionNote: IPC-7351 Footprint Added.; PackageReference: 0402-A; Publisher: Altium Limited; PackageDescription: Chip Inductor; Code_JEITA: 0402; Value: 1K
U6 = Volt Reg: Voltage Regulator; Fabricant: TAIWAN SEMICONDUCTOR; Fournisseur: Farnell; RefFournisseur: 7261390; RefFabricant: TS2940CP-3.3 C5
U7 = 25HK-AB-050A400-CP: Power adapter; RefFournisseur: 2334613; Fabricant: IDEAL POWER; Fournisseur: Farnell; RefFabricant: 25HK-AB-050A400-CP

## Nets that join several sheets
GND: RainbowClock (19 pins), Bluetooth (P2.4), LCD (P1.1 P1.5 P1.16 R7.3), Temperature (P3.2 R9.1), NEOPIXEL/NeoPixel1 (C10#1.1 U3#1.3), NEOPIXEL/NeoPixel2 (C10#2.1 U3#2.3), NEOPIXEL/NeoPixel3 (C10#3.1 U3#3.3), NEOPIXEL/NeoPixel4 (C10#4.1 U3#4.3), NEOPIXEL/NeoPixel5 (C10#5.1 U3#5.3), NEOPIXEL/NeoPixel6 (C10#6.1 U3#6.3), NEOPIXEL/NeoPixel7 (C10#7.1 U3#7.3), NEOPIXEL/NeoPixel8 (C10#8.1 U3#8.3), NEOPIXEL/NeoPixel9 (C10#9.1 U3#9.3), NEOPIXEL/NeoPixel10 (C10#10.1 U3#10.3), NEOPIXEL/NeoPixel11 (C10#11.1 U3#11.3), NEOPIXEL/NeoPixel12 (C10#12.1 U3#12.3), NEOPIXEL/NeoPixel13 (C10#13.1 U3#13.3), NEOPIXEL/NeoPixel14 (C10#14.1 U3#14.3), NEOPIXEL/NeoPixel15 (C10#15.1 U3#15.3), NEOPIXEL/NeoPixel16 (C10#16.1 U3#16.3), NEOPIXEL/NeoPixel17 (C10#17.1 U3#17.3), NEOPIXEL/NeoPixel18 (C10#18.1 U3#18.3), NEOPIXEL/NeoPixel19 (C10#19.1 U3#19.3), NEOPIXEL/NeoPixel20 (C10#20.1 U3#20.3), NEOPIXEL/NeoPixel21 (C10#21.1 U3#21.3), NEOPIXEL/NeoPixel22 (C10#22.1 U3#22.3), NEOPIXEL/NeoPixel23 (C10#23.1 U3#23.3), NEOPIXEL/NeoPixel24 (C10#24.1 U3#24.3), NEOPIXEL/NeoPixel25 (C10#25.1 U3#25.3), NEOPIXEL/NeoPixel26 (C10#26.1 U3#26.3), NEOPIXEL/NeoPixel27 (C10#27.1 U3#27.3), NEOPIXEL/NeoPixel28 (C10#28.1 U3#28.3), NEOPIXEL/NeoPixel29 (C10#29.1 U3#29.3), NEOPIXEL/NeoPixel30 (C10#30.1 U3#30.3), NEOPIXEL/NeoPixel31 (C10#31.1 U3#31.3), NEOPIXEL/NeoPixel32 (C10#32.1 U3#32.3), NEOPIXEL/NeoPixel33 (C10#33.1 U3#33.3), NEOPIXEL/NeoPixel34 (C10#34.1 U3#34.3), NEOPIXEL/NeoPixel35 (C10#35.1 U3#35.3), NEOPIXEL/NeoPixel36 (C10#36.1 U3#36.3), NEOPIXEL/NeoPixel37 (C10#37.1 U3#37.3), NEOPIXEL/NeoPixel38 (C10#38.1 U3#38.3), NEOPIXEL/NeoPixel39 (C10#39.1 U3#39.3), NEOPIXEL/NeoPixel40 (C10#40.1 U3#40.3), NEOPIXEL/NeoPixel41 (C10#41.1 U3#41.3), NEOPIXEL/NeoPixel42 (C10#42.1 U3#42.3), NEOPIXEL/NeoPixel43 (C10#43.1 U3#43.3), NEOPIXEL/NeoPixel44 (C10#44.1 U3#44.3), NEOPIXEL/NeoPixel45 (C10#45.1 U3#45.3), NEOPIXEL/NeoPixel46 (C10#46.1 U3#46.3), NEOPIXEL/NeoPixel47 (C10#47.1 U3#47.3), NEOPIXEL/NeoPixel48 (C10#48.1 U3#48.3), NEOPIXEL/NeoPixel49 (C10#49.1 U3#49.3), NEOPIXEL/NeoPixel50 (C10#50.1 U3#50.3), NEOPIXEL/NeoPixel51 (C10#51.1 U3#51.3), NEOPIXEL/NeoPixel52 (C10#52.1 U3#52.3), NEOPIXEL/NeoPixel53 (C10#53.1 U3#53.3), NEOPIXEL/NeoPixel54 (C10#54.1 U3#54.3), NEOPIXEL/NeoPixel55 (C10#55.1 U3#55.3), NEOPIXEL/NeoPixel56 (C10#56.1 U3#56.3), NEOPIXEL/NeoPixel57 (C10#57.1 U3#57.3), NEOPIXEL/NeoPixel58 (C10#58.1 U3#58.3), NEOPIXEL/NeoPixel59 (C10#59.1 U3#59.3), NEOPIXEL/NeoPixel60 (C10#60.1 U3#60.3), Power (5 pins)
V3P3: RainbowClock (9 pins), Bluetooth (P2.5), Temperature (P3.1 R8.1), Power (C12.2 L1.1 U6.3)
V3P3A: RainbowClock (C6.2 LDR1.1 U1.17), Power (L1.2)
V5: LCD (P1.2 R7.1), NEOPIXEL/NeoPixel1 (C10#1.2 U3#1.1), NEOPIXEL/NeoPixel2 (C10#2.2 U3#2.1), NEOPIXEL/NeoPixel3 (C10#3.2 U3#3.1), NEOPIXEL/NeoPixel4 (C10#4.2 U3#4.1), NEOPIXEL/NeoPixel5 (C10#5.2 U3#5.1), NEOPIXEL/NeoPixel6 (C10#6.2 U3#6.1), NEOPIXEL/NeoPixel7 (C10#7.2 U3#7.1), NEOPIXEL/NeoPixel8 (C10#8.2 U3#8.1), NEOPIXEL/NeoPixel9 (C10#9.2 U3#9.1), NEOPIXEL/NeoPixel10 (C10#10.2 U3#10.1), NEOPIXEL/NeoPixel11 (C10#11.2 U3#11.1), NEOPIXEL/NeoPixel12 (C10#12.2 U3#12.1), NEOPIXEL/NeoPixel13 (C10#13.2 U3#13.1), NEOPIXEL/NeoPixel14 (C10#14.2 U3#14.1), NEOPIXEL/NeoPixel15 (C10#15.2 U3#15.1), NEOPIXEL/NeoPixel16 (C10#16.2 U3#16.1), NEOPIXEL/NeoPixel17 (C10#17.2 U3#17.1), NEOPIXEL/NeoPixel18 (C10#18.2 U3#18.1), NEOPIXEL/NeoPixel19 (C10#19.2 U3#19.1), NEOPIXEL/NeoPixel20 (C10#20.2 U3#20.1), NEOPIXEL/NeoPixel21 (C10#21.2 U3#21.1), NEOPIXEL/NeoPixel22 (C10#22.2 U3#22.1), NEOPIXEL/NeoPixel23 (C10#23.2 U3#23.1), NEOPIXEL/NeoPixel24 (C10#24.2 U3#24.1), NEOPIXEL/NeoPixel25 (C10#25.2 U3#25.1), NEOPIXEL/NeoPixel26 (C10#26.2 U3#26.1), NEOPIXEL/NeoPixel27 (C10#27.2 U3#27.1), NEOPIXEL/NeoPixel28 (C10#28.2 U3#28.1), NEOPIXEL/NeoPixel29 (C10#29.2 U3#29.1), NEOPIXEL/NeoPixel30 (C10#30.2 U3#30.1), NEOPIXEL/NeoPixel31 (C10#31.2 U3#31.1), NEOPIXEL/NeoPixel32 (C10#32.2 U3#32.1), NEOPIXEL/NeoPixel33 (C10#33.2 U3#33.1), NEOPIXEL/NeoPixel34 (C10#34.2 U3#34.1), NEOPIXEL/NeoPixel35 (C10#35.2 U3#35.1), NEOPIXEL/NeoPixel36 (C10#36.2 U3#36.1), NEOPIXEL/NeoPixel37 (C10#37.2 U3#37.1), NEOPIXEL/NeoPixel38 (C10#38.2 U3#38.1), NEOPIXEL/NeoPixel39 (C10#39.2 U3#39.1), NEOPIXEL/NeoPixel40 (C10#40.2 U3#40.1), NEOPIXEL/NeoPixel41 (C10#41.2 U3#41.1), NEOPIXEL/NeoPixel42 (C10#42.2 U3#42.1), NEOPIXEL/NeoPixel43 (C10#43.2 U3#43.1), NEOPIXEL/NeoPixel44 (C10#44.2 U3#44.1), NEOPIXEL/NeoPixel45 (C10#45.2 U3#45.1), NEOPIXEL/NeoPixel46 (C10#46.2 U3#46.1), NEOPIXEL/NeoPixel47 (C10#47.2 U3#47.1), NEOPIXEL/NeoPixel48 (C10#48.2 U3#48.1), NEOPIXEL/NeoPixel49 (C10#49.2 U3#49.1), NEOPIXEL/NeoPixel50 (C10#50.2 U3#50.1), NEOPIXEL/NeoPixel51 (C10#51.2 U3#51.1), NEOPIXEL/NeoPixel52 (C10#52.2 U3#52.1), NEOPIXEL/NeoPixel53 (C10#53.2 U3#53.1), NEOPIXEL/NeoPixel54 (C10#54.2 U3#54.1), NEOPIXEL/NeoPixel55 (C10#55.2 U3#55.1), NEOPIXEL/NeoPixel56 (C10#56.2 U3#56.1), NEOPIXEL/NeoPixel57 (C10#57.2 U3#57.1), NEOPIXEL/NeoPixel58 (C10#58.2 U3#58.1), NEOPIXEL/NeoPixel59 (C10#59.2 U3#59.1), NEOPIXEL/NeoPixel60 (C10#60.2 U3#60.1), Power (C11.2 J2.1 U6.1)
D0: RainbowClock (U1.8), LCD (P1.7)
D1: RainbowClock (U1.9), LCD (P1.8)
D2: RainbowClock (U1.10), LCD (P1.9)
D3: RainbowClock (U1.11), LCD (P1.10)
D4: RainbowClock (U1.12), LCD (P1.11)
D5: RainbowClock (U1.13), LCD (P1.12)
D6: RainbowClock (U1.14), LCD (P1.13)
D7: RainbowClock (U1.15), LCD (P1.14)
DOUT: RainbowClock (U1.23), NEOPIXEL/NeoPixel60 (U3#60.2)
E: RainbowClock (U1.3), LCD (P1.6)
LED+: RainbowClock (U1.2), LCD (P1.15)
PX1: RainbowClock (U1.24), NEOPIXEL/NeoPixel1 (U3#1.4)
PX2: NEOPIXEL/NeoPixel1 (U3#1.2), NEOPIXEL/NeoPixel2 (U3#2.4)
PX3: NEOPIXEL/NeoPixel2 (U3#2.2), NEOPIXEL/NeoPixel3 (U3#3.4)
PX4: NEOPIXEL/NeoPixel3 (U3#3.2), NEOPIXEL/NeoPixel4 (U3#4.4)
PX5: NEOPIXEL/NeoPixel4 (U3#4.2), NEOPIXEL/NeoPixel5 (U3#5.4)
PX6: NEOPIXEL/NeoPixel5 (U3#5.2), NEOPIXEL/NeoPixel6 (U3#6.4)
PX7: NEOPIXEL/NeoPixel6 (U3#6.2), NEOPIXEL/NeoPixel7 (U3#7.4)
PX8: NEOPIXEL/NeoPixel7 (U3#7.2), NEOPIXEL/NeoPixel8 (U3#8.4)
PX9: NEOPIXEL/NeoPixel8 (U3#8.2), NEOPIXEL/NeoPixel9 (U3#9.4)
PX10: NEOPIXEL/NeoPixel9 (U3#9.2), NEOPIXEL/NeoPixel10 (U3#10.4)
PX11: NEOPIXEL/NeoPixel10 (U3#10.2), NEOPIXEL/NeoPixel11 (U3#11.4)
PX12: NEOPIXEL/NeoPixel11 (U3#11.2), NEOPIXEL/NeoPixel12 (U3#12.4)
PX13: NEOPIXEL/NeoPixel12 (U3#12.2), NEOPIXEL/NeoPixel13 (U3#13.4)
PX14: NEOPIXEL/NeoPixel13 (U3#13.2), NEOPIXEL/NeoPixel14 (U3#14.4)
PX15: NEOPIXEL/NeoPixel14 (U3#14.2), NEOPIXEL/NeoPixel15 (U3#15.4)
PX16: NEOPIXEL/NeoPixel15 (U3#15.2), NEOPIXEL/NeoPixel16 (U3#16.4)
PX17: NEOPIXEL/NeoPixel16 (U3#16.2), NEOPIXEL/NeoPixel17 (U3#17.4)
PX18: NEOPIXEL/NeoPixel17 (U3#17.2), NEOPIXEL/NeoPixel18 (U3#18.4)
PX19: NEOPIXEL/NeoPixel18 (U3#18.2), NEOPIXEL/NeoPixel19 (U3#19.4)
PX20: NEOPIXEL/NeoPixel19 (U3#19.2), NEOPIXEL/NeoPixel20 (U3#20.4)
PX21: NEOPIXEL/NeoPixel20 (U3#20.2), NEOPIXEL/NeoPixel21 (U3#21.4)
PX22: NEOPIXEL/NeoPixel21 (U3#21.2), NEOPIXEL/NeoPixel22 (U3#22.4)
PX23: NEOPIXEL/NeoPixel22 (U3#22.2), NEOPIXEL/NeoPixel23 (U3#23.4)
PX24: NEOPIXEL/NeoPixel23 (U3#23.2), NEOPIXEL/NeoPixel24 (U3#24.4)
PX25: NEOPIXEL/NeoPixel24 (U3#24.2), NEOPIXEL/NeoPixel25 (U3#25.4)
PX26: NEOPIXEL/NeoPixel25 (U3#25.2), NEOPIXEL/NeoPixel26 (U3#26.4)
PX27: NEOPIXEL/NeoPixel26 (U3#26.2), NEOPIXEL/NeoPixel27 (U3#27.4)
PX28: NEOPIXEL/NeoPixel27 (U3#27.2), NEOPIXEL/NeoPixel28 (U3#28.4)
PX29: NEOPIXEL/NeoPixel28 (U3#28.2), NEOPIXEL/NeoPixel29 (U3#29.4)
PX30: NEOPIXEL/NeoPixel29 (U3#29.2), NEOPIXEL/NeoPixel30 (U3#30.4)
PX31: NEOPIXEL/NeoPixel30 (U3#30.2), NEOPIXEL/NeoPixel31 (U3#31.4)
PX32: NEOPIXEL/NeoPixel31 (U3#31.2), NEOPIXEL/NeoPixel32 (U3#32.4)
PX33: NEOPIXEL/NeoPixel32 (U3#32.2), NEOPIXEL/NeoPixel33 (U3#33.4)
PX34: NEOPIXEL/NeoPixel33 (U3#33.2), NEOPIXEL/NeoPixel34 (U3#34.4)
PX35: NEOPIXEL/NeoPixel34 (U3#34.2), NEOPIXEL/NeoPixel35 (U3#35.4)
PX36: NEOPIXEL/NeoPixel35 (U3#35.2), NEOPIXEL/NeoPixel36 (U3#36.4)
PX37: NEOPIXEL/NeoPixel36 (U3#36.2), NEOPIXEL/NeoPixel37 (U3#37.4)
PX38: NEOPIXEL/NeoPixel37 (U3#37.2), NEOPIXEL/NeoPixel38 (U3#38.4)
PX39: NEOPIXEL/NeoPixel38 (U3#38.2), NEOPIXEL/NeoPixel39 (U3#39.4)
PX40: NEOPIXEL/NeoPixel39 (U3#39.2), NEOPIXEL/NeoPixel40 (U3#40.4)
PX41: NEOPIXEL/NeoPixel40 (U3#40.2), NEOPIXEL/NeoPixel41 (U3#41.4)
PX42: NEOPIXEL/NeoPixel41 (U3#41.2), NEOPIXEL/NeoPixel42 (U3#42.4)
PX43: NEOPIXEL/NeoPixel42 (U3#42.2), NEOPIXEL/NeoPixel43 (U3#43.4)
PX44: NEOPIXEL/NeoPixel43 (U3#43.2), NEOPIXEL/NeoPixel44 (U3#44.4)
PX45: NEOPIXEL/NeoPixel44 (U3#44.2), NEOPIXEL/NeoPixel45 (U3#45.4)
PX46: NEOPIXEL/NeoPixel45 (U3#45.2), NEOPIXEL/NeoPixel46 (U3#46.4)
PX47: NEOPIXEL/NeoPixel46 (U3#46.2), NEOPIXEL/NeoPixel47 (U3#47.4)
PX48: NEOPIXEL/NeoPixel47 (U3#47.2), NEOPIXEL/NeoPixel48 (U3#48.4)
PX49: NEOPIXEL/NeoPixel48 (U3#48.2), NEOPIXEL/NeoPixel49 (U3#49.4)
PX50: NEOPIXEL/NeoPixel49 (U3#49.2), NEOPIXEL/NeoPixel50 (U3#50.4)
PX51: NEOPIXEL/NeoPixel50 (U3#50.2), NEOPIXEL/NeoPixel51 (U3#51.4)
PX52: NEOPIXEL/NeoPixel51 (U3#51.2), NEOPIXEL/NeoPixel52 (U3#52.4)
PX53: NEOPIXEL/NeoPixel52 (U3#52.2), NEOPIXEL/NeoPixel53 (U3#53.4)
PX54: NEOPIXEL/NeoPixel53 (U3#53.2), NEOPIXEL/NeoPixel54 (U3#54.4)
PX55: NEOPIXEL/NeoPixel54 (U3#54.2), NEOPIXEL/NeoPixel55 (U3#55.4)
PX56: NEOPIXEL/NeoPixel55 (U3#55.2), NEOPIXEL/NeoPixel56 (U3#56.4)
PX57: NEOPIXEL/NeoPixel56 (U3#56.2), NEOPIXEL/NeoPixel57 (U3#57.4)
PX58: NEOPIXEL/NeoPixel57 (U3#57.2), NEOPIXEL/NeoPixel58 (U3#58.4)
PX59: NEOPIXEL/NeoPixel58 (U3#58.2), NEOPIXEL/NeoPixel59 (U3#59.4)
PX60: NEOPIXEL/NeoPixel59 (U3#59.2), NEOPIXEL/NeoPixel60 (U3#60.4)
RS: RainbowClock (U1.5), LCD (P1.4)
RX: RainbowClock (U1.19), Bluetooth (P2.2)
SCL: RainbowClock (U1.44), Temperature (P3.3)
SDA: RainbowClock (U1.1), Temperature (P3.4)
TX: RainbowClock (U1.42), Bluetooth (P2.3)